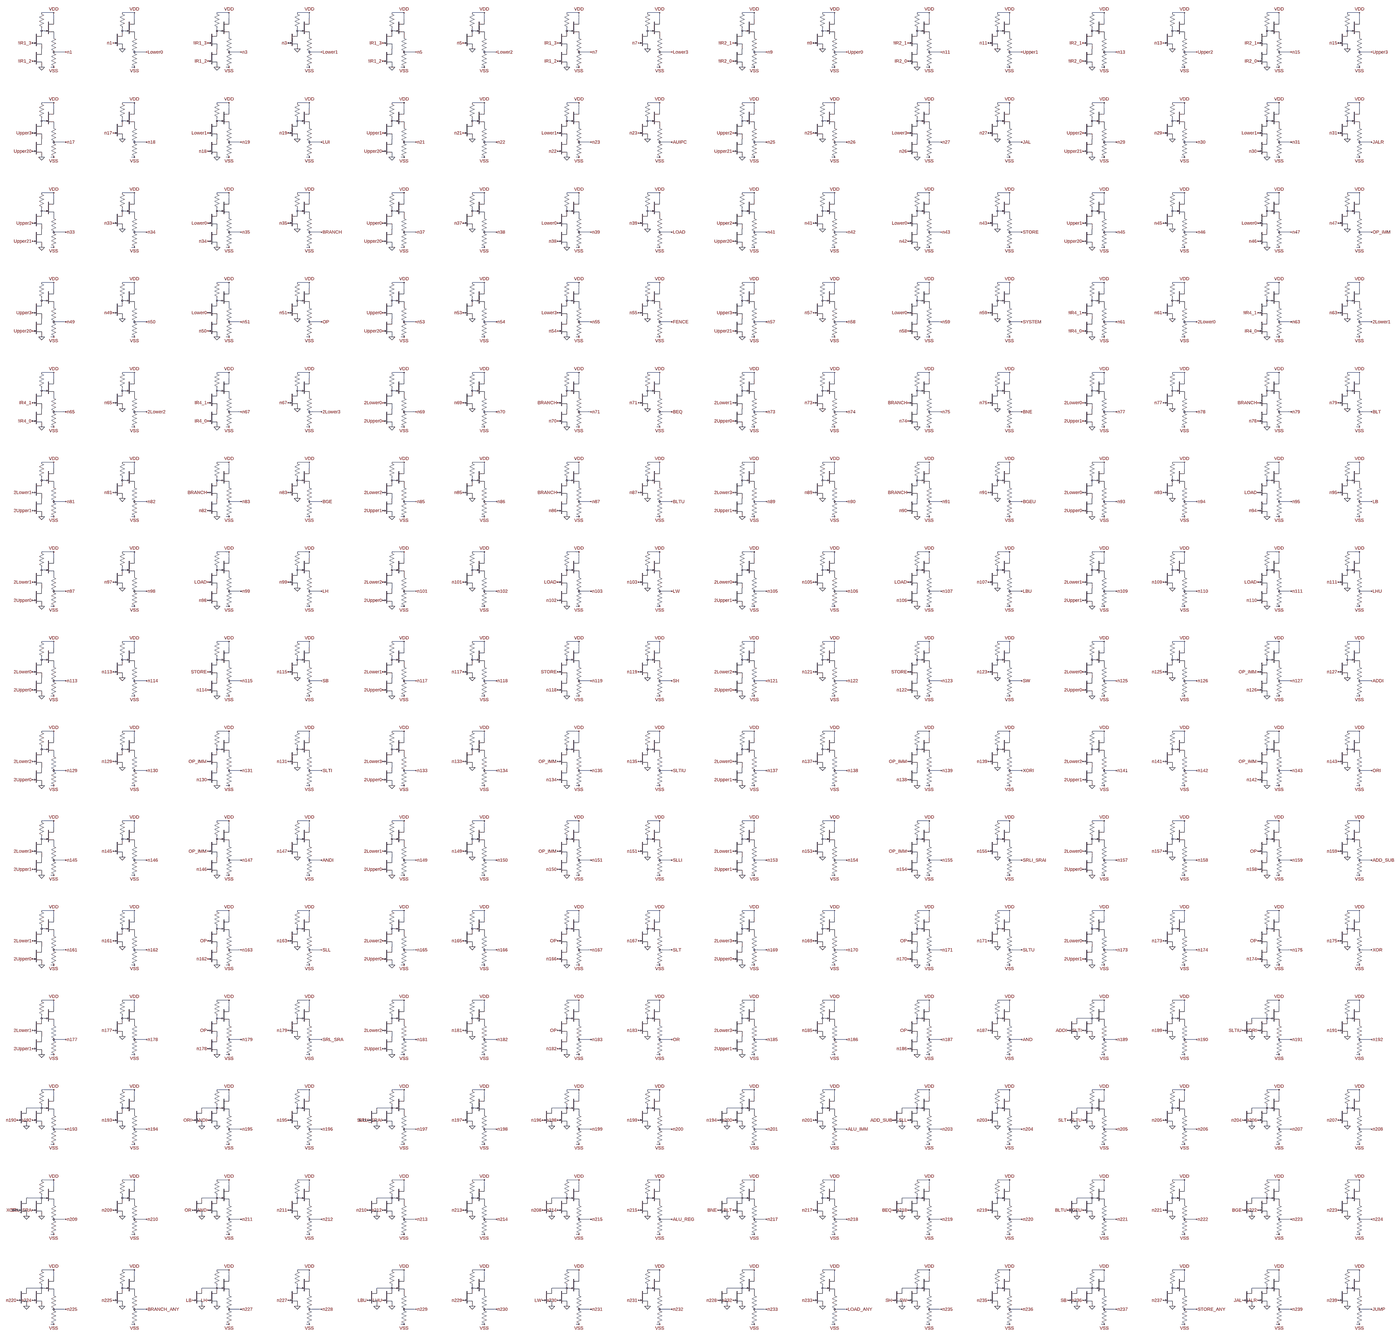
[diagram p0: schematic rv32i_decoder.asc, whole sheet]
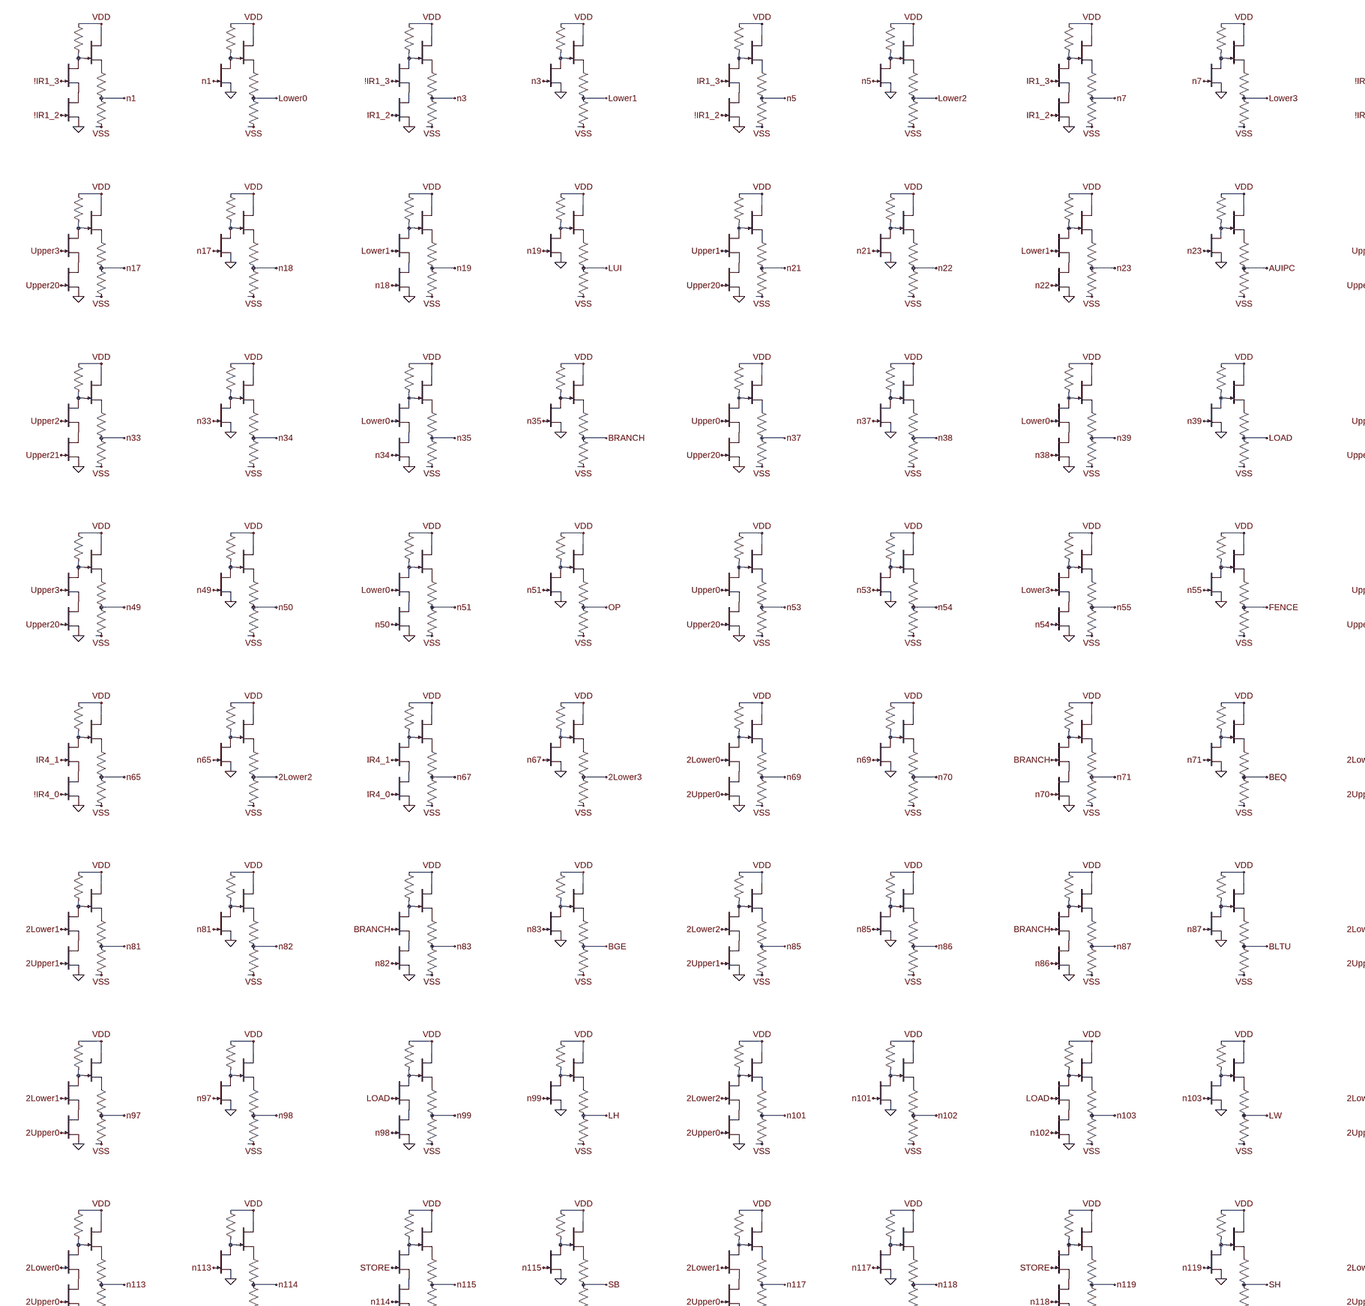
[diagram p1: schematic rv32i_decoder.asc, part, row 1 of 2, column 1 of 2]
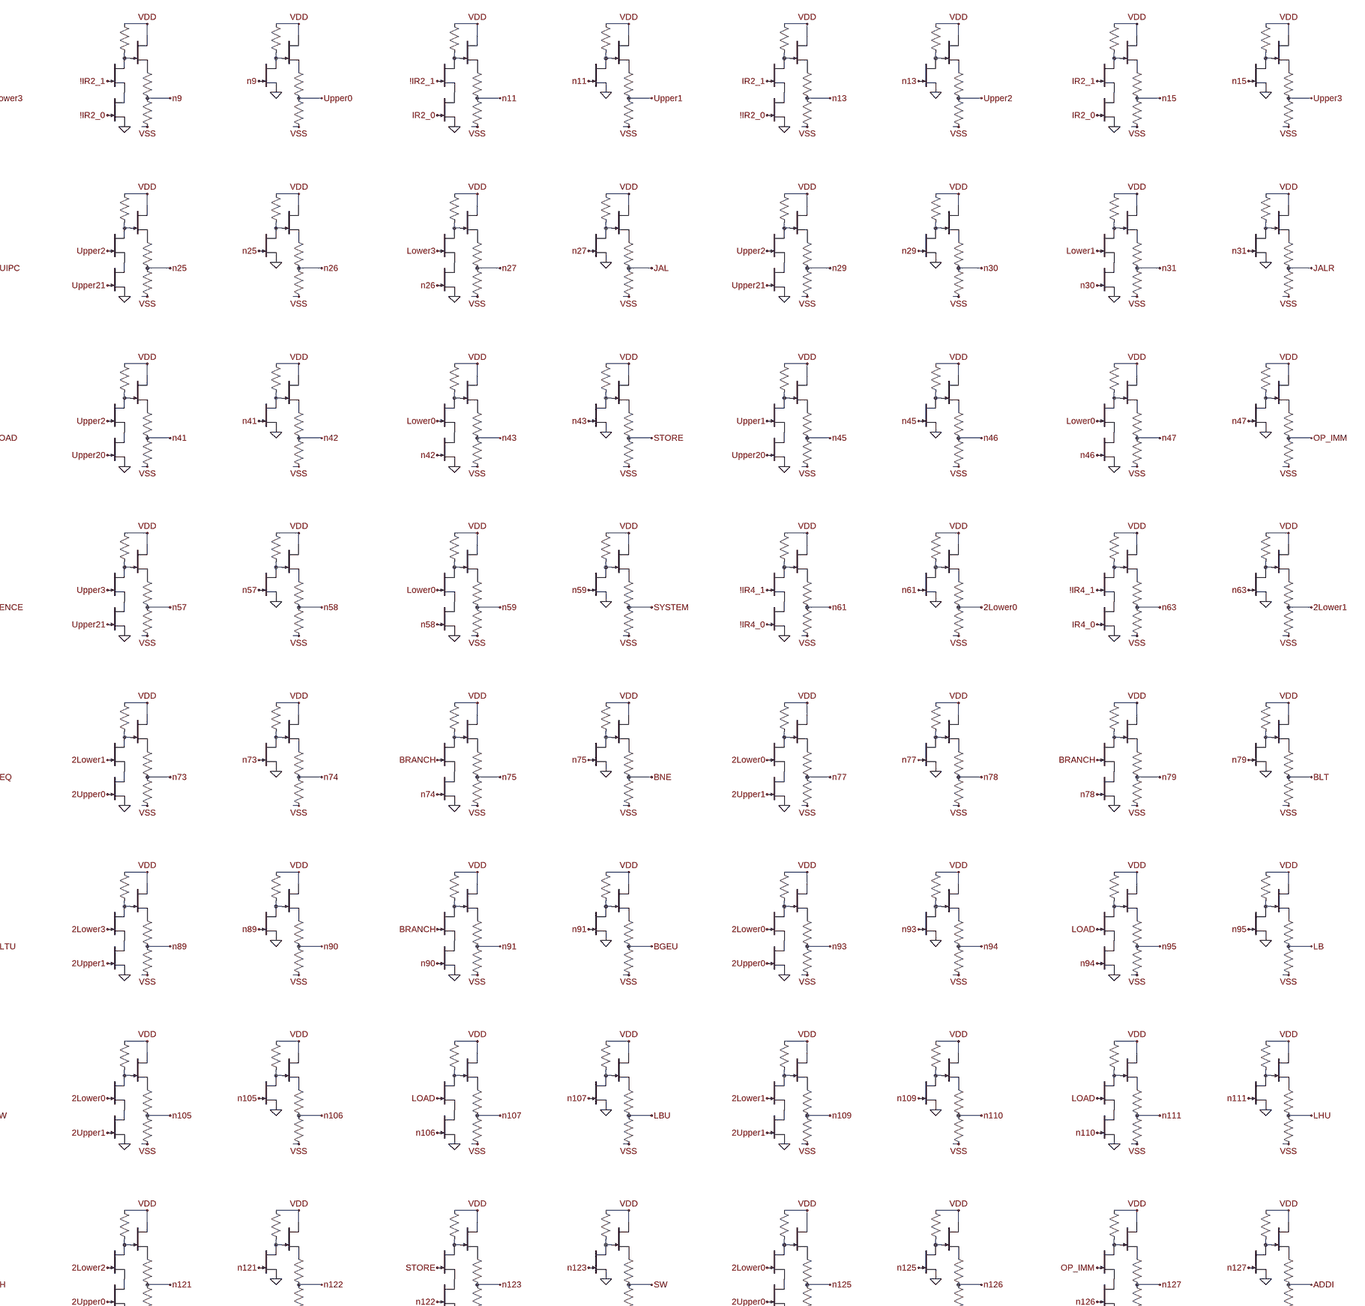
[diagram p2: schematic rv32i_decoder.asc, part, row 1 of 2, column 2 of 2]
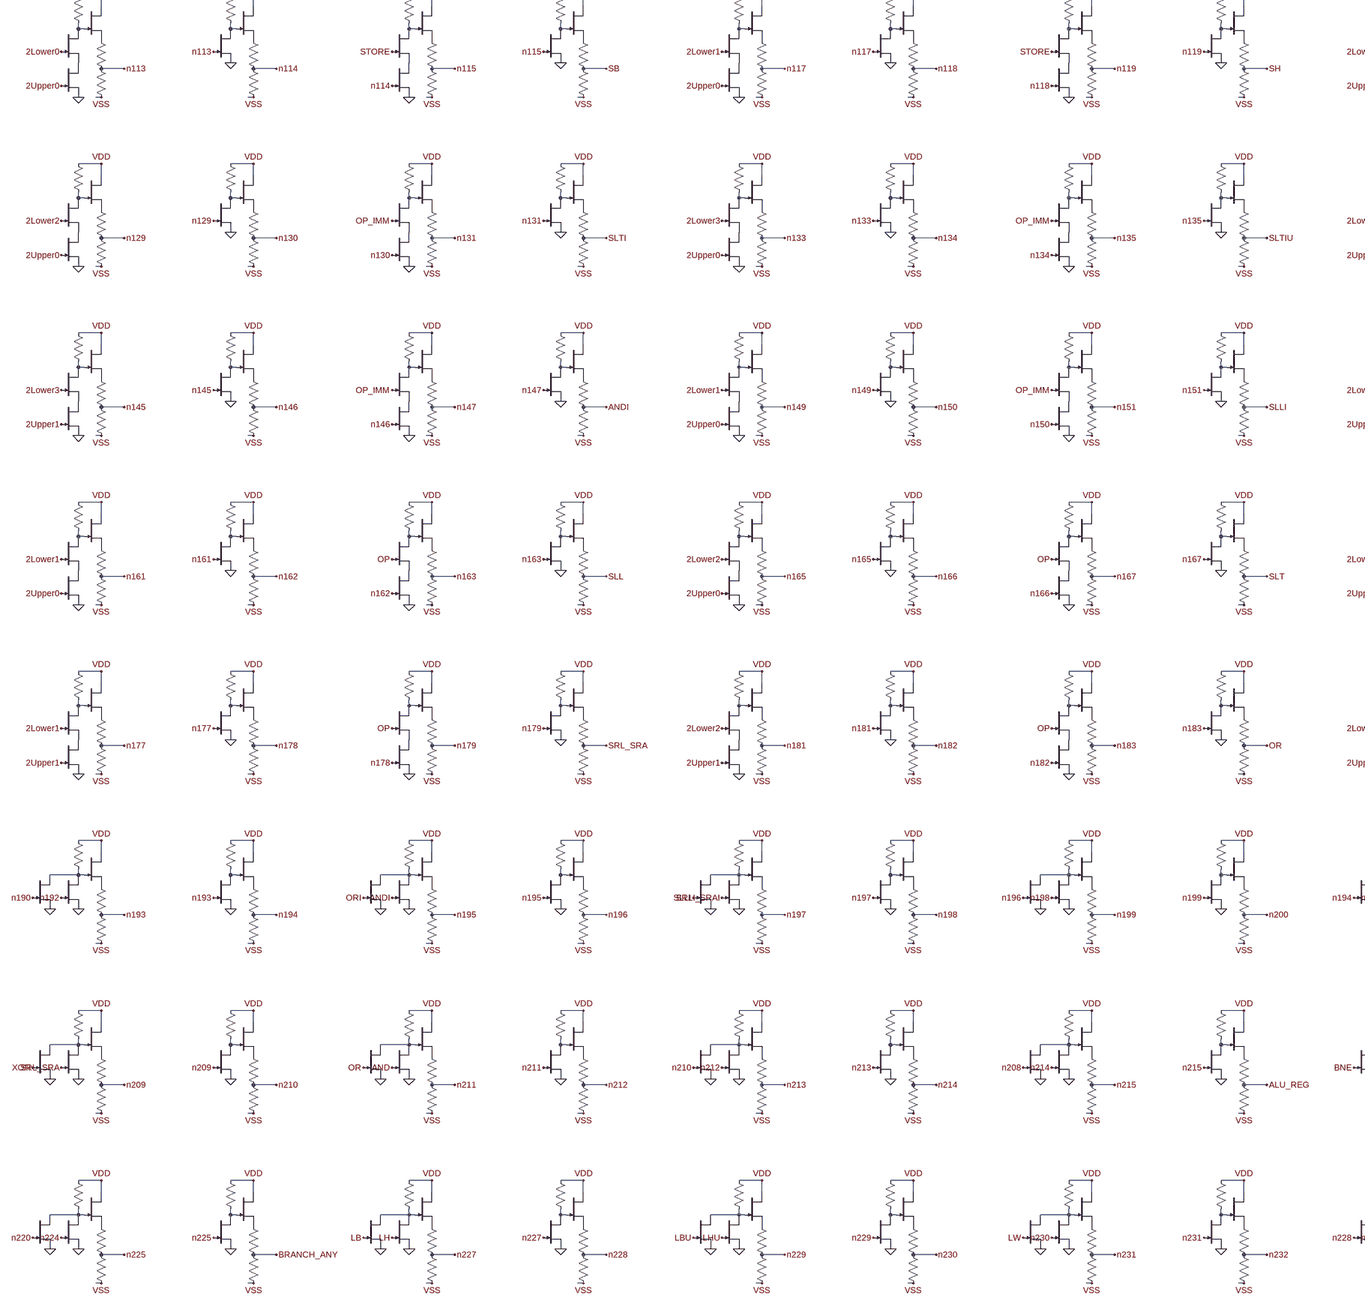
[diagram p3: schematic rv32i_decoder.asc, part, row 2 of 2, column 1 of 2]
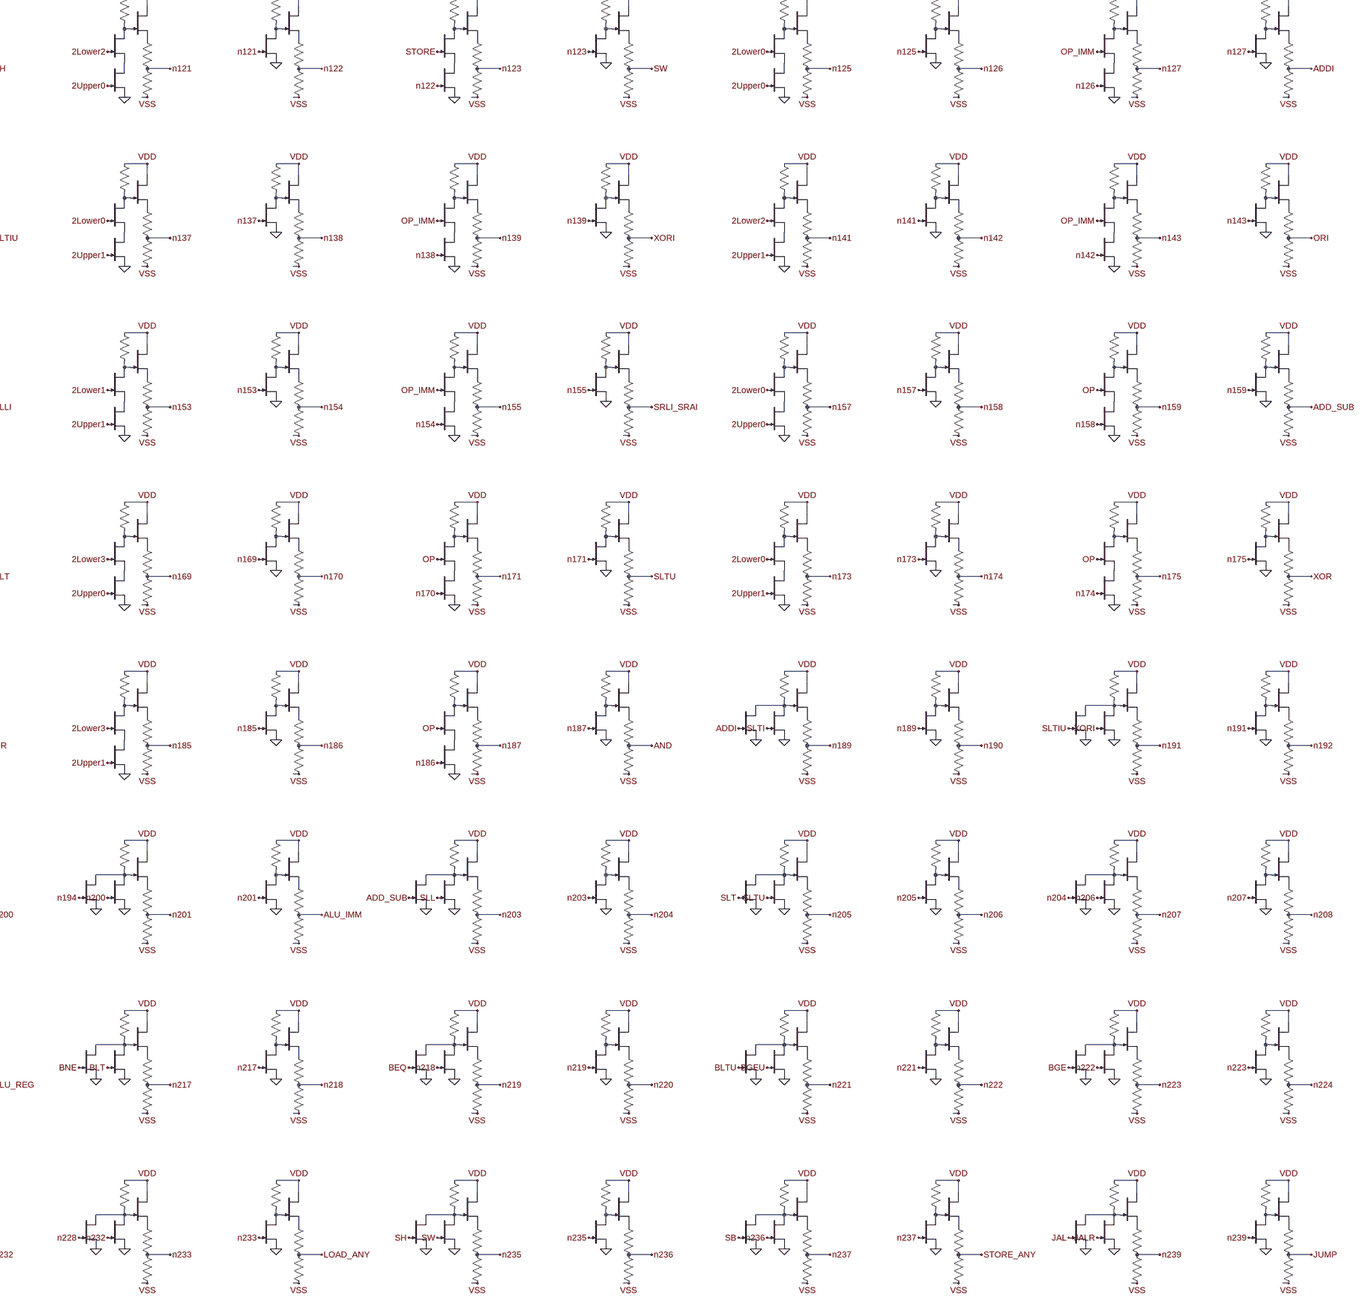
[diagram p4: schematic rv32i_decoder.asc, part, row 2 of 2, column 2 of 2]
* rv32i_decoder.asc
R1 VDD N001 100k
J_F1 VDD N001 P001 DR
R2 P001 n1 1k
R3 n1 VSS 4.8k
J_B1 N001 !IR1_3 P002 DR
J_A1 P002 !IR1_2 0 DR
R4 VDD N002 100k
J_F2 VDD N002 P003 DR
R5 P003 Lower0 1k
R6 Lower0 VSS 4.8k
J_B2 N002 n1 0 DR
R7 VDD N003 100k
J_F3 VDD N003 P004 DR
R8 P004 n3 1k
R9 n3 VSS 4.8k
J_B3 N003 !IR1_3 P005 DR
J_A2 P005 IR1_2 0 DR
R10 VDD N004 100k
J_F4 VDD N004 P006 DR
R11 P006 Lower1 1k
R12 Lower1 VSS 4.8k
J_B4 N004 n3 0 DR
R13 VDD N005 100k
J_F5 VDD N005 P007 DR
R14 P007 n5 1k
R15 n5 VSS 4.8k
J_B5 N005 IR1_3 P008 DR
J_A3 P008 !IR1_2 0 DR
R16 VDD N006 100k
J_F6 VDD N006 P009 DR
R17 P009 Lower2 1k
R18 Lower2 VSS 4.8k
J_B6 N006 n5 0 DR
R19 VDD N007 100k
J_F7 VDD N007 P010 DR
R20 P010 n7 1k
R21 n7 VSS 4.8k
J_B7 N007 IR1_3 P011 DR
J_A4 P011 IR1_2 0 DR
R22 VDD N008 100k
J_F8 VDD N008 P012 DR
R23 P012 Lower3 1k
R24 Lower3 VSS 4.8k
J_B8 N008 n7 0 DR
R25 VDD N009 100k
J_F9 VDD N009 P013 DR
R26 P013 n9 1k
R27 n9 VSS 4.8k
J_B9 N009 !IR2_1 P014 DR
J_A5 P014 !IR2_0 0 DR
R28 VDD N010 100k
J_F10 VDD N010 P015 DR
R29 P015 Upper0 1k
R30 Upper0 VSS 4.8k
J_B10 N010 n9 0 DR
R31 VDD N011 100k
J_F11 VDD N011 P016 DR
R32 P016 n11 1k
R33 n11 VSS 4.8k
J_B11 N011 !IR2_1 P017 DR
J_A6 P017 IR2_0 0 DR
R34 VDD N012 100k
J_F12 VDD N012 P018 DR
R35 P018 Upper1 1k
R36 Upper1 VSS 4.8k
J_B12 N012 n11 0 DR
R37 VDD N013 100k
J_F13 VDD N013 P019 DR
R38 P019 n13 1k
R39 n13 VSS 4.8k
J_B13 N013 IR2_1 P020 DR
J_A7 P020 !IR2_0 0 DR
R40 VDD N014 100k
J_F14 VDD N014 P021 DR
R41 P021 Upper2 1k
R42 Upper2 VSS 4.8k
J_B14 N014 n13 0 DR
R43 VDD N015 100k
J_F15 VDD N015 P022 DR
R44 P022 n15 1k
R45 n15 VSS 4.8k
J_B15 N015 IR2_1 P023 DR
J_A8 P023 IR2_0 0 DR
R46 VDD N016 100k
J_F16 VDD N016 P024 DR
R47 P024 Upper3 1k
R48 Upper3 VSS 4.8k
J_B16 N016 n15 0 DR
R49 VDD N017 100k
J_F17 VDD N017 P025 DR
R50 P025 n17 1k
R51 n17 VSS 4.8k
J_B17 N017 Upper3 P026 DR
J_A9 P026 Upper20 0 DR
R52 VDD N018 100k
J_F18 VDD N018 P027 DR
R53 P027 n18 1k
R54 n18 VSS 4.8k
J_B18 N018 n17 0 DR
R55 VDD N019 100k
J_F19 VDD N019 P028 DR
R56 P028 n19 1k
R57 n19 VSS 4.8k
J_B19 N019 Lower1 P029 DR
J_A10 P029 n18 0 DR
R58 VDD N020 100k
J_F20 VDD N020 P030 DR
R59 P030 LUI 1k
R60 LUI VSS 4.8k
J_B20 N020 n19 0 DR
R61 VDD N021 100k
J_F21 VDD N021 P031 DR
R62 P031 n21 1k
R63 n21 VSS 4.8k
J_B21 N021 Upper1 P032 DR
J_A11 P032 Upper20 0 DR
R64 VDD N022 100k
J_F22 VDD N022 P033 DR
R65 P033 n22 1k
R66 n22 VSS 4.8k
J_B22 N022 n21 0 DR
R67 VDD N023 100k
J_F23 VDD N023 P034 DR
R68 P034 n23 1k
R69 n23 VSS 4.8k
J_B23 N023 Lower1 P035 DR
J_A12 P035 n22 0 DR
R70 VDD N024 100k
J_F24 VDD N024 P036 DR
R71 P036 AUIPC 1k
R72 AUIPC VSS 4.8k
J_B24 N024 n23 0 DR
R73 VDD N025 100k
J_F25 VDD N025 P037 DR
R74 P037 n25 1k
R75 n25 VSS 4.8k
J_B25 N025 Upper2 P038 DR
J_A13 P038 Upper21 0 DR
R76 VDD N026 100k
J_F26 VDD N026 P039 DR
R77 P039 n26 1k
R78 n26 VSS 4.8k
J_B26 N026 n25 0 DR
R79 VDD N027 100k
J_F27 VDD N027 P040 DR
R80 P040 n27 1k
R81 n27 VSS 4.8k
J_B27 N027 Lower3 P041 DR
J_A14 P041 n26 0 DR
R82 VDD N028 100k
J_F28 VDD N028 P042 DR
R83 P042 JAL 1k
R84 JAL VSS 4.8k
J_B28 N028 n27 0 DR
R85 VDD N029 100k
J_F29 VDD N029 P043 DR
R86 P043 n29 1k
R87 n29 VSS 4.8k
J_B29 N029 Upper2 P044 DR
J_A15 P044 Upper21 0 DR
R88 VDD N030 100k
J_F30 VDD N030 P045 DR
R89 P045 n30 1k
R90 n30 VSS 4.8k
J_B30 N030 n29 0 DR
R91 VDD N031 100k
J_F31 VDD N031 P046 DR
R92 P046 n31 1k
R93 n31 VSS 4.8k
J_B31 N031 Lower1 P047 DR
J_A16 P047 n30 0 DR
R94 VDD N032 100k
J_F32 VDD N032 P048 DR
R95 P048 JALR 1k
R96 JALR VSS 4.8k
J_B32 N032 n31 0 DR
R97 VDD N033 100k
J_F33 VDD N033 P049 DR
R98 P049 n33 1k
R99 n33 VSS 4.8k
J_B33 N033 Upper2 P050 DR
J_A17 P050 Upper21 0 DR
R100 VDD N034 100k
J_F34 VDD N034 P051 DR
R101 P051 n34 1k
R102 n34 VSS 4.8k
J_B34 N034 n33 0 DR
R103 VDD N035 100k
J_F35 VDD N035 P052 DR
R104 P052 n35 1k
R105 n35 VSS 4.8k
J_B35 N035 Lower0 P053 DR
J_A18 P053 n34 0 DR
R106 VDD N036 100k
J_F36 VDD N036 P054 DR
R107 P054 BRANCH 1k
R108 BRANCH VSS 4.8k
J_B36 N036 n35 0 DR
R109 VDD N037 100k
J_F37 VDD N037 P055 DR
R110 P055 n37 1k
R111 n37 VSS 4.8k
J_B37 N037 Upper0 P056 DR
J_A19 P056 Upper20 0 DR
R112 VDD N038 100k
J_F38 VDD N038 P057 DR
R113 P057 n38 1k
R114 n38 VSS 4.8k
J_B38 N038 n37 0 DR
R115 VDD N039 100k
J_F39 VDD N039 P058 DR
R116 P058 n39 1k
R117 n39 VSS 4.8k
J_B39 N039 Lower0 P059 DR
J_A20 P059 n38 0 DR
R118 VDD N040 100k
J_F40 VDD N040 P060 DR
R119 P060 LOAD 1k
R120 LOAD VSS 4.8k
J_B40 N040 n39 0 DR
R121 VDD N041 100k
J_F41 VDD N041 P061 DR
R122 P061 n41 1k
R123 n41 VSS 4.8k
J_B41 N041 Upper2 P062 DR
J_A21 P062 Upper20 0 DR
R124 VDD N042 100k
J_F42 VDD N042 P063 DR
R125 P063 n42 1k
R126 n42 VSS 4.8k
J_B42 N042 n41 0 DR
R127 VDD N043 100k
J_F43 VDD N043 P064 DR
R128 P064 n43 1k
R129 n43 VSS 4.8k
J_B43 N043 Lower0 P065 DR
J_A22 P065 n42 0 DR
R130 VDD N044 100k
J_F44 VDD N044 P066 DR
R131 P066 STORE 1k
R132 STORE VSS 4.8k
J_B44 N044 n43 0 DR
R133 VDD N045 100k
J_F45 VDD N045 P067 DR
R134 P067 n45 1k
R135 n45 VSS 4.8k
J_B45 N045 Upper1 P068 DR
J_A23 P068 Upper20 0 DR
R136 VDD N046 100k
J_F46 VDD N046 P069 DR
R137 P069 n46 1k
R138 n46 VSS 4.8k
J_B46 N046 n45 0 DR
R139 VDD N047 100k
J_F47 VDD N047 P070 DR
R140 P070 n47 1k
R141 n47 VSS 4.8k
J_B47 N047 Lower0 P071 DR
J_A24 P071 n46 0 DR
R142 VDD N048 100k
J_F48 VDD N048 P072 DR
R143 P072 OP_IMM 1k
R144 OP_IMM VSS 4.8k
J_B48 N048 n47 0 DR
R145 VDD N049 100k
J_F49 VDD N049 P073 DR
R146 P073 n49 1k
R147 n49 VSS 4.8k
J_B49 N049 Upper3 P074 DR
J_A25 P074 Upper20 0 DR
R148 VDD N050 100k
J_F50 VDD N050 P075 DR
R149 P075 n50 1k
R150 n50 VSS 4.8k
J_B50 N050 n49 0 DR
R151 VDD N051 100k
J_F51 VDD N051 P076 DR
R152 P076 n51 1k
R153 n51 VSS 4.8k
J_B51 N051 Lower0 P077 DR
J_A26 P077 n50 0 DR
R154 VDD N052 100k
J_F52 VDD N052 P078 DR
R155 P078 OP 1k
R156 OP VSS 4.8k
J_B52 N052 n51 0 DR
R157 VDD N053 100k
J_F53 VDD N053 P079 DR
R158 P079 n53 1k
R159 n53 VSS 4.8k
J_B53 N053 Upper0 P080 DR
J_A27 P080 Upper20 0 DR
R160 VDD N054 100k
J_F54 VDD N054 P081 DR
R161 P081 n54 1k
R162 n54 VSS 4.8k
J_B54 N054 n53 0 DR
R163 VDD N055 100k
J_F55 VDD N055 P082 DR
R164 P082 n55 1k
R165 n55 VSS 4.8k
J_B55 N055 Lower3 P083 DR
J_A28 P083 n54 0 DR
R166 VDD N056 100k
J_F56 VDD N056 P084 DR
R167 P084 FENCE 1k
R168 FENCE VSS 4.8k
J_B56 N056 n55 0 DR
R169 VDD N057 100k
J_F57 VDD N057 P085 DR
R170 P085 n57 1k
R171 n57 VSS 4.8k
J_B57 N057 Upper3 P086 DR
J_A29 P086 Upper21 0 DR
R172 VDD N058 100k
J_F58 VDD N058 P087 DR
R173 P087 n58 1k
R174 n58 VSS 4.8k
J_B58 N058 n57 0 DR
R175 VDD N059 100k
J_F59 VDD N059 P088 DR
R176 P088 n59 1k
R177 n59 VSS 4.8k
J_B59 N059 Lower0 P089 DR
J_A30 P089 n58 0 DR
R178 VDD N060 100k
J_F60 VDD N060 P090 DR
R179 P090 SYSTEM 1k
R180 SYSTEM VSS 4.8k
J_B60 N060 n59 0 DR
R181 VDD N061 100k
J_F61 VDD N061 P091 DR
R182 P091 n61 1k
R183 n61 VSS 4.8k
J_B61 N061 !IR4_1 P092 DR
J_A31 P092 !IR4_0 0 DR
R184 VDD N062 100k
J_F62 VDD N062 P093 DR
R185 P093 2Lower0 1k
R186 2Lower0 VSS 4.8k
J_B62 N062 n61 0 DR
R187 VDD N063 100k
J_F63 VDD N063 P094 DR
R188 P094 n63 1k
R189 n63 VSS 4.8k
J_B63 N063 !IR4_1 P095 DR
J_A32 P095 IR4_0 0 DR
R190 VDD N064 100k
J_F64 VDD N064 P096 DR
R191 P096 2Lower1 1k
R192 2Lower1 VSS 4.8k
J_B64 N064 n63 0 DR
R193 VDD N065 100k
J_F65 VDD N065 P097 DR
R194 P097 n65 1k
R195 n65 VSS 4.8k
J_B65 N065 IR4_1 P098 DR
J_A33 P098 !IR4_0 0 DR
R196 VDD N066 100k
J_F66 VDD N066 P099 DR
R197 P099 2Lower2 1k
R198 2Lower2 VSS 4.8k
J_B66 N066 n65 0 DR
R199 VDD N067 100k
J_F67 VDD N067 P100 DR
R200 P100 n67 1k
R201 n67 VSS 4.8k
J_B67 N067 IR4_1 P101 DR
J_A34 P101 IR4_0 0 DR
R202 VDD N068 100k
J_F68 VDD N068 P102 DR
R203 P102 2Lower3 1k
R204 2Lower3 VSS 4.8k
J_B68 N068 n67 0 DR
R205 VDD N069 100k
J_F69 VDD N069 P103 DR
R206 P103 n69 1k
R207 n69 VSS 4.8k
J_B69 N069 2Lower0 P104 DR
J_A35 P104 2Upper0 0 DR
R208 VDD N070 100k
J_F70 VDD N070 P105 DR
R209 P105 n70 1k
R210 n70 VSS 4.8k
J_B70 N070 n69 0 DR
R211 VDD N071 100k
J_F71 VDD N071 P106 DR
R212 P106 n71 1k
R213 n71 VSS 4.8k
J_B71 N071 BRANCH P107 DR
J_A36 P107 n70 0 DR
R214 VDD N072 100k
J_F72 VDD N072 P108 DR
R215 P108 BEQ 1k
R216 BEQ VSS 4.8k
J_B72 N072 n71 0 DR
R217 VDD N073 100k
J_F73 VDD N073 P109 DR
R218 P109 n73 1k
R219 n73 VSS 4.8k
J_B73 N073 2Lower1 P110 DR
J_A37 P110 2Upper0 0 DR
R220 VDD N074 100k
J_F74 VDD N074 P111 DR
R221 P111 n74 1k
R222 n74 VSS 4.8k
J_B74 N074 n73 0 DR
R223 VDD N075 100k
J_F75 VDD N075 P112 DR
R224 P112 n75 1k
R225 n75 VSS 4.8k
J_B75 N075 BRANCH P113 DR
J_A38 P113 n74 0 DR
R226 VDD N076 100k
J_F76 VDD N076 P114 DR
R227 P114 BNE 1k
R228 BNE VSS 4.8k
J_B76 N076 n75 0 DR
R229 VDD N077 100k
J_F77 VDD N077 P115 DR
R230 P115 n77 1k
R231 n77 VSS 4.8k
J_B77 N077 2Lower0 P116 DR
J_A39 P116 2Upper1 0 DR
R232 VDD N078 100k
J_F78 VDD N078 P117 DR
R233 P117 n78 1k
R234 n78 VSS 4.8k
J_B78 N078 n77 0 DR
R235 VDD N079 100k
J_F79 VDD N079 P118 DR
R236 P118 n79 1k
R237 n79 VSS 4.8k
J_B79 N079 BRANCH P119 DR
J_A40 P119 n78 0 DR
R238 VDD N080 100k
J_F80 VDD N080 P120 DR
R239 P120 BLT 1k
R240 BLT VSS 4.8k
J_B80 N080 n79 0 DR
R241 VDD N081 100k
J_F81 VDD N081 P121 DR
R242 P121 n81 1k
R243 n81 VSS 4.8k
J_B81 N081 2Lower1 P122 DR
J_A41 P122 2Upper1 0 DR
R244 VDD N082 100k
J_F82 VDD N082 P123 DR
R245 P123 n82 1k
R246 n82 VSS 4.8k
J_B82 N082 n81 0 DR
R247 VDD N083 100k
J_F83 VDD N083 P124 DR
R248 P124 n83 1k
R249 n83 VSS 4.8k
J_B83 N083 BRANCH P125 DR
J_A42 P125 n82 0 DR
R250 VDD N084 100k
J_F84 VDD N084 P126 DR
R251 P126 BGE 1k
R252 BGE VSS 4.8k
J_B84 N084 n83 0 DR
R253 VDD N085 100k
J_F85 VDD N085 P127 DR
R254 P127 n85 1k
R255 n85 VSS 4.8k
J_B85 N085 2Lower2 P128 DR
J_A43 P128 2Upper1 0 DR
R256 VDD N086 100k
J_F86 VDD N086 P129 DR
R257 P129 n86 1k
R258 n86 VSS 4.8k
J_B86 N086 n85 0 DR
R259 VDD N087 100k
J_F87 VDD N087 P130 DR
R260 P130 n87 1k
R261 n87 VSS 4.8k
J_B87 N087 BRANCH P131 DR
J_A44 P131 n86 0 DR
R262 VDD N088 100k
J_F88 VDD N088 P132 DR
R263 P132 BLTU 1k
R264 BLTU VSS 4.8k
J_B88 N088 n87 0 DR
R265 VDD N089 100k
J_F89 VDD N089 P133 DR
R266 P133 n89 1k
R267 n89 VSS 4.8k
J_B89 N089 2Lower3 P134 DR
J_A45 P134 2Upper1 0 DR
R268 VDD N090 100k
J_F90 VDD N090 P135 DR
R269 P135 n90 1k
R270 n90 VSS 4.8k
J_B90 N090 n89 0 DR
R271 VDD N091 100k
J_F91 VDD N091 P136 DR
R272 P136 n91 1k
R273 n91 VSS 4.8k
J_B91 N091 BRANCH P137 DR
J_A46 P137 n90 0 DR
R274 VDD N092 100k
J_F92 VDD N092 P138 DR
R275 P138 BGEU 1k
R276 BGEU VSS 4.8k
J_B92 N092 n91 0 DR
R277 VDD N093 100k
J_F93 VDD N093 P139 DR
R278 P139 n93 1k
R279 n93 VSS 4.8k
J_B93 N093 2Lower0 P140 DR
J_A47 P140 2Upper0 0 DR
R280 VDD N094 100k
J_F94 VDD N094 P141 DR
R281 P141 n94 1k
R282 n94 VSS 4.8k
J_B94 N094 n93 0 DR
R283 VDD N095 100k
J_F95 VDD N095 P142 DR
R284 P142 n95 1k
R285 n95 VSS 4.8k
J_B95 N095 LOAD P143 DR
J_A48 P143 n94 0 DR
R286 VDD N096 100k
J_F96 VDD N096 P144 DR
R287 P144 LB 1k
R288 LB VSS 4.8k
J_B96 N096 n95 0 DR
R289 VDD N097 100k
J_F97 VDD N097 P145 DR
R290 P145 n97 1k
R291 n97 VSS 4.8k
J_B97 N097 2Lower1 P146 DR
J_A49 P146 2Upper0 0 DR
R292 VDD N098 100k
J_F98 VDD N098 P147 DR
R293 P147 n98 1k
R294 n98 VSS 4.8k
J_B98 N098 n97 0 DR
R295 VDD N099 100k
J_F99 VDD N099 P148 DR
R296 P148 n99 1k
R297 n99 VSS 4.8k
J_B99 N099 LOAD P149 DR
J_A50 P149 n98 0 DR
R298 VDD N100 100k
J_F100 VDD N100 P150 DR
R299 P150 LH 1k
R300 LH VSS 4.8k
J_B100 N100 n99 0 DR
R301 VDD N104 100k
J_F101 VDD N104 P151 DR
R302 P151 n101 1k
R303 n101 VSS 4.8k
J_B101 N104 2Lower2 P152 DR
J_A51 P152 2Upper0 0 DR
R304 VDD N108 100k
J_F102 VDD N108 P153 DR
R305 P153 n102 1k
R306 n102 VSS 4.8k
J_B102 N108 n101 0 DR
R307 VDD N112 100k
J_F103 VDD N112 P154 DR
R308 P154 n103 1k
R309 n103 VSS 4.8k
J_B103 N112 LOAD P155 DR
J_A52 P155 n102 0 DR
R310 VDD N116 100k
J_F104 VDD N116 P156 DR
R311 P156 LW 1k
R312 LW VSS 4.8k
J_B104 N116 n103 0 DR
R313 VDD N120 100k
J_F105 VDD N120 P157 DR
R314 P157 n105 1k
R315 n105 VSS 4.8k
J_B105 N120 2Lower0 P158 DR
J_A53 P158 2Upper1 0 DR
R316 VDD N124 100k
J_F106 VDD N124 P159 DR
R317 P159 n106 1k
R318 n106 VSS 4.8k
J_B106 N124 n105 0 DR
R319 VDD N128 100k
J_F107 VDD N128 P160 DR
R320 P160 n107 1k
R321 n107 VSS 4.8k
J_B107 N128 LOAD P161 DR
J_A54 P161 n106 0 DR
R322 VDD N132 100k
J_F108 VDD N132 P162 DR
R323 P162 LBU 1k
R324 LBU VSS 4.8k
J_B108 N132 n107 0 DR
R325 VDD N136 100k
J_F109 VDD N136 P163 DR
R326 P163 n109 1k
R327 n109 VSS 4.8k
J_B109 N136 2Lower1 P164 DR
J_A55 P164 2Upper1 0 DR
R328 VDD N140 100k
J_F110 VDD N140 P165 DR
R329 P165 n110 1k
R330 n110 VSS 4.8k
J_B110 N140 n109 0 DR
R331 VDD N144 100k
J_F111 VDD N144 P166 DR
R332 P166 n111 1k
R333 n111 VSS 4.8k
J_B111 N144 LOAD P167 DR
J_A56 P167 n110 0 DR
R334 VDD N148 100k
J_F112 VDD N148 P168 DR
R335 P168 LHU 1k
R336 LHU VSS 4.8k
J_B112 N148 n111 0 DR
R337 VDD N152 100k
J_F113 VDD N152 P169 DR
R338 P169 n113 1k
R339 n113 VSS 4.8k
J_B113 N152 2Lower0 P170 DR
J_A57 P170 2Upper0 0 DR
R340 VDD N156 100k
J_F114 VDD N156 P171 DR
R341 P171 n114 1k
R342 n114 VSS 4.8k
J_B114 N156 n113 0 DR
R343 VDD N160 100k
J_F115 VDD N160 P172 DR
R344 P172 n115 1k
R345 n115 VSS 4.8k
J_B115 N160 STORE P173 DR
J_A58 P173 n114 0 DR
R346 VDD N164 100k
J_F116 VDD N164 P174 DR
R347 P174 SB 1k
R348 SB VSS 4.8k
J_B116 N164 n115 0 DR
R349 VDD N168 100k
J_F117 VDD N168 P175 DR
R350 P175 n117 1k
R351 n117 VSS 4.8k
J_B117 N168 2Lower1 P176 DR
J_A59 P176 2Upper0 0 DR
R352 VDD N172 100k
J_F118 VDD N172 P177 DR
R353 P177 n118 1k
R354 n118 VSS 4.8k
J_B118 N172 n117 0 DR
R355 VDD N176 100k
J_F119 VDD N176 P178 DR
R356 P178 n119 1k
R357 n119 VSS 4.8k
J_B119 N176 STORE P179 DR
J_A60 P179 n118 0 DR
R358 VDD N180 100k
J_F120 VDD N180 P180 DR
R359 P180 SH 1k
R360 SH VSS 4.8k
J_B120 N180 n119 0 DR
R361 VDD N184 100k
J_F121 VDD N184 P181 DR
R362 P181 n121 1k
R363 n121 VSS 4.8k
J_B121 N184 2Lower2 P182 DR
J_A61 P182 2Upper0 0 DR
R364 VDD N188 100k
J_F122 VDD N188 P183 DR
R365 P183 n122 1k
R366 n122 VSS 4.8k
J_B122 N188 n121 0 DR
R367 VDD N202 100k
J_F123 VDD N202 P184 DR
R368 P184 n123 1k
R369 n123 VSS 4.8k
J_B123 N202 STORE P185 DR
J_A62 P185 n122 0 DR
R370 VDD N216 100k
J_F124 VDD N216 P186 DR
R371 P186 SW 1k
R372 SW VSS 4.8k
J_B124 N216 n123 0 DR
R373 VDD N226 100k
J_F125 VDD N226 P187 DR
R374 P187 n125 1k
R375 n125 VSS 4.8k
J_B125 N226 2Lower0 P188 DR
J_A63 P188 2Upper0 0 DR
R376 VDD N234 100k
J_F126 VDD N234 P189 DR
R377 P189 n126 1k
R378 n126 VSS 4.8k
J_B126 N234 n125 0 DR
R379 VDD N238 100k
J_F127 VDD N238 P190 DR
R380 P190 n127 1k
R381 n127 VSS 4.8k
J_B127 N238 OP_IMM P191 DR
J_A64 P191 n126 0 DR
R382 VDD N240 100k
J_F128 VDD N240 P192 DR
R383 P192 ADDI 1k
R384 ADDI VSS 4.8k
J_B128 N240 n127 0 DR
R385 VDD N241 100k
J_F129 VDD N241 P193 DR
R386 P193 n129 1k
R387 n129 VSS 4.8k
J_B129 N241 2Lower2 P194 DR
J_A65 P194 2Upper0 0 DR
R388 VDD N242 100k
J_F130 VDD N242 P195 DR
R389 P195 n130 1k
R390 n130 VSS 4.8k
J_B130 N242 n129 0 DR
R391 VDD N243 100k
J_F131 VDD N243 P196 DR
R392 P196 n131 1k
R393 n131 VSS 4.8k
J_B131 N243 OP_IMM P197 DR
J_A66 P197 n130 0 DR
R394 VDD N244 100k
J_F132 VDD N244 P198 DR
R395 P198 SLTI 1k
R396 SLTI VSS 4.8k
J_B132 N244 n131 0 DR
R397 VDD N245 100k
J_F133 VDD N245 P199 DR
R398 P199 n133 1k
R399 n133 VSS 4.8k
J_B133 N245 2Lower3 P200 DR
J_A67 P200 2Upper0 0 DR
R400 VDD N246 100k
J_F134 VDD N246 P201 DR
R401 P201 n134 1k
R402 n134 VSS 4.8k
J_B134 N246 n133 0 DR
R403 VDD N247 100k
J_F135 VDD N247 P202 DR
R404 P202 n135 1k
R405 n135 VSS 4.8k
J_B135 N247 OP_IMM P203 DR
J_A68 P203 n134 0 DR
R406 VDD N248 100k
J_F136 VDD N248 P204 DR
R407 P204 SLTIU 1k
R408 SLTIU VSS 4.8k
J_B136 N248 n135 0 DR
R409 VDD N249 100k
J_F137 VDD N249 P205 DR
R410 P205 n137 1k
R411 n137 VSS 4.8k
J_B137 N249 2Lower0 P206 DR
J_A69 P206 2Upper1 0 DR
R412 VDD N250 100k
J_F138 VDD N250 P207 DR
R413 P207 n138 1k
R414 n138 VSS 4.8k
J_B138 N250 n137 0 DR
R415 VDD N251 100k
J_F139 VDD N251 P208 DR
R416 P208 n139 1k
R417 n139 VSS 4.8k
J_B139 N251 OP_IMM P209 DR
J_A70 P209 n138 0 DR
R418 VDD N252 100k
J_F140 VDD N252 P210 DR
R419 P210 XORI 1k
R420 XORI VSS 4.8k
J_B140 N252 n139 0 DR
R421 VDD N253 100k
J_F141 VDD N253 P211 DR
R422 P211 n141 1k
R423 n141 VSS 4.8k
J_B141 N253 2Lower2 P212 DR
J_A71 P212 2Upper1 0 DR
R424 VDD N254 100k
J_F142 VDD N254 P213 DR
R425 P213 n142 1k
R426 n142 VSS 4.8k
J_B142 N254 n141 0 DR
R427 VDD N255 100k
J_F143 VDD N255 P214 DR
R428 P214 n143 1k
R429 n143 VSS 4.8k
J_B143 N255 OP_IMM P215 DR
J_A72 P215 n142 0 DR
R430 VDD N256 100k
J_F144 VDD N256 P216 DR
R431 P216 ORI 1k
R432 ORI VSS 4.8k
J_B144 N256 n143 0 DR
R433 VDD N257 100k
J_F145 VDD N257 P217 DR
R434 P217 n145 1k
R435 n145 VSS 4.8k
J_B145 N257 2Lower3 P218 DR
J_A73 P218 2Upper1 0 DR
R436 VDD N258 100k
J_F146 VDD N258 P219 DR
R437 P219 n146 1k
R438 n146 VSS 4.8k
J_B146 N258 n145 0 DR
R439 VDD N259 100k
J_F147 VDD N259 P220 DR
R440 P220 n147 1k
R441 n147 VSS 4.8k
J_B147 N259 OP_IMM P221 DR
J_A74 P221 n146 0 DR
R442 VDD N260 100k
J_F148 VDD N260 P222 DR
R443 P222 ANDI 1k
R444 ANDI VSS 4.8k
J_B148 N260 n147 0 DR
R445 VDD N261 100k
J_F149 VDD N261 P223 DR
R446 P223 n149 1k
R447 n149 VSS 4.8k
J_B149 N261 2Lower1 P224 DR
J_A75 P224 2Upper0 0 DR
R448 VDD N262 100k
J_F150 VDD N262 P225 DR
R449 P225 n150 1k
R450 n150 VSS 4.8k
J_B150 N262 n149 0 DR
R451 VDD N263 100k
J_F151 VDD N263 P226 DR
R452 P226 n151 1k
R453 n151 VSS 4.8k
J_B151 N263 OP_IMM P227 DR
J_A76 P227 n150 0 DR
R454 VDD N264 100k
J_F152 VDD N264 P228 DR
R455 P228 SLLI 1k
R456 SLLI VSS 4.8k
J_B152 N264 n151 0 DR
R457 VDD N265 100k
J_F153 VDD N265 P229 DR
R458 P229 n153 1k
R459 n153 VSS 4.8k
J_B153 N265 2Lower1 P230 DR
J_A77 P230 2Upper1 0 DR
R460 VDD N266 100k
J_F154 VDD N266 P231 DR
R461 P231 n154 1k
R462 n154 VSS 4.8k
J_B154 N266 n153 0 DR
R463 VDD N267 100k
J_F155 VDD N267 P232 DR
R464 P232 n155 1k
R465 n155 VSS 4.8k
J_B155 N267 OP_IMM P233 DR
J_A78 P233 n154 0 DR
R466 VDD N268 100k
J_F156 VDD N268 P234 DR
R467 P234 SRLI_SRAI 1k
R468 SRLI_SRAI VSS 4.8k
J_B156 N268 n155 0 DR
R469 VDD N269 100k
J_F157 VDD N269 P235 DR
R470 P235 n157 1k
R471 n157 VSS 4.8k
J_B157 N269 2Lower0 P236 DR
J_A79 P236 2Upper0 0 DR
R472 VDD N270 100k
J_F158 VDD N270 P237 DR
R473 P237 n158 1k
R474 n158 VSS 4.8k
J_B158 N270 n157 0 DR
R475 VDD N271 100k
J_F159 VDD N271 P238 DR
R476 P238 n159 1k
R477 n159 VSS 4.8k
J_B159 N271 OP P239 DR
J_A80 P239 n158 0 DR
R478 VDD N272 100k
J_F160 VDD N272 P240 DR
R479 P240 ADD_SUB 1k
R480 ADD_SUB VSS 4.8k
J_B160 N272 n159 0 DR
R481 VDD N273 100k
J_F161 VDD N273 P241 DR
R482 P241 n161 1k
R483 n161 VSS 4.8k
J_B161 N273 2Lower1 P242 DR
J_A81 P242 2Upper0 0 DR
R484 VDD N274 100k
J_F162 VDD N274 P243 DR
R485 P243 n162 1k
R486 n162 VSS 4.8k
J_B162 N274 n161 0 DR
R487 VDD N275 100k
J_F163 VDD N275 P244 DR
R488 P244 n163 1k
R489 n163 VSS 4.8k
J_B163 N275 OP P245 DR
J_A82 P245 n162 0 DR
R490 VDD N276 100k
J_F164 VDD N276 P246 DR
R491 P246 SLL 1k
R492 SLL VSS 4.8k
J_B164 N276 n163 0 DR
R493 VDD N277 100k
J_F165 VDD N277 P247 DR
R494 P247 n165 1k
R495 n165 VSS 4.8k
J_B165 N277 2Lower2 P248 DR
J_A83 P248 2Upper0 0 DR
R496 VDD N278 100k
J_F166 VDD N278 P249 DR
R497 P249 n166 1k
R498 n166 VSS 4.8k
J_B166 N278 n165 0 DR
R499 VDD N279 100k
J_F167 VDD N279 P250 DR
R500 P250 n167 1k
R501 n167 VSS 4.8k
J_B167 N279 OP P251 DR
J_A84 P251 n166 0 DR
R502 VDD N280 100k
J_F168 VDD N280 P252 DR
R503 P252 SLT 1k
R504 SLT VSS 4.8k
J_B168 N280 n167 0 DR
R505 VDD N281 100k
J_F169 VDD N281 P253 DR
R506 P253 n169 1k
R507 n169 VSS 4.8k
J_B169 N281 2Lower3 P254 DR
J_A85 P254 2Upper0 0 DR
R508 VDD N282 100k
J_F170 VDD N282 P255 DR
R509 P255 n170 1k
R510 n170 VSS 4.8k
J_B170 N282 n169 0 DR
R511 VDD N283 100k
J_F171 VDD N283 P256 DR
R512 P256 n171 1k
R513 n171 VSS 4.8k
J_B171 N283 OP P257 DR
J_A86 P257 n170 0 DR
R514 VDD N284 100k
J_F172 VDD N284 P258 DR
R515 P258 SLTU 1k
R516 SLTU VSS 4.8k
J_B172 N284 n171 0 DR
R517 VDD N285 100k
J_F173 VDD N285 P259 DR
R518 P259 n173 1k
R519 n173 VSS 4.8k
J_B173 N285 2Lower0 P260 DR
J_A87 P260 2Upper1 0 DR
R520 VDD N286 100k
J_F174 VDD N286 P261 DR
R521 P261 n174 1k
R522 n174 VSS 4.8k
J_B174 N286 n173 0 DR
R523 VDD N287 100k
J_F175 VDD N287 P262 DR
R524 P262 n175 1k
R525 n175 VSS 4.8k
J_B175 N287 OP P263 DR
J_A88 P263 n174 0 DR
R526 VDD N288 100k
J_F176 VDD N288 P264 DR
R527 P264 XOR 1k
R528 XOR VSS 4.8k
J_B176 N288 n175 0 DR
R529 VDD N289 100k
J_F177 VDD N289 P265 DR
R530 P265 n177 1k
R531 n177 VSS 4.8k
J_B177 N289 2Lower1 P266 DR
J_A89 P266 2Upper1 0 DR
R532 VDD N290 100k
J_F178 VDD N290 P267 DR
R533 P267 n178 1k
R534 n178 VSS 4.8k
J_B178 N290 n177 0 DR
R535 VDD N291 100k
J_F179 VDD N291 P268 DR
R536 P268 n179 1k
R537 n179 VSS 4.8k
J_B179 N291 OP P269 DR
J_A90 P269 n178 0 DR
R538 VDD N292 100k
J_F180 VDD N292 P270 DR
R539 P270 SRL_SRA 1k
R540 SRL_SRA VSS 4.8k
J_B180 N292 n179 0 DR
R541 VDD N293 100k
J_F181 VDD N293 P271 DR
R542 P271 n181 1k
R543 n181 VSS 4.8k
J_B181 N293 2Lower2 P272 DR
J_A91 P272 2Upper1 0 DR
R544 VDD N294 100k
J_F182 VDD N294 P273 DR
R545 P273 n182 1k
R546 n182 VSS 4.8k
J_B182 N294 n181 0 DR
R547 VDD N295 100k
J_F183 VDD N295 P274 DR
R548 P274 n183 1k
R549 n183 VSS 4.8k
J_B183 N295 OP P275 DR
J_A92 P275 n182 0 DR
R550 VDD N296 100k
J_F184 VDD N296 P276 DR
R551 P276 OR 1k
R552 OR VSS 4.8k
J_B184 N296 n183 0 DR
R553 VDD N297 100k
J_F185 VDD N297 P277 DR
R554 P277 n185 1k
R555 n185 VSS 4.8k
J_B185 N297 2Lower3 P278 DR
J_A93 P278 2Upper1 0 DR
R556 VDD N298 100k
J_F186 VDD N298 P279 DR
R557 P279 n186 1k
R558 n186 VSS 4.8k
J_B186 N298 n185 0 DR
R559 VDD N299 100k
J_F187 VDD N299 P280 DR
R560 P280 n187 1k
R561 n187 VSS 4.8k
J_B187 N299 OP P281 DR
J_A94 P281 n186 0 DR
R562 VDD N300 100k
J_F188 VDD N300 P282 DR
R563 P282 AND 1k
R564 AND VSS 4.8k
J_B188 N300 n187 0 DR
R565 VDD N301 100k
J_F189 VDD N301 P283 DR
R566 P283 n189 1k
R567 n189 VSS 4.8k
J_B189 N301 SLTI 0 DR
J_B190 N301 ADDI 0 DR
R568 VDD N302 100k
J_F190 VDD N302 P284 DR
R569 P284 n190 1k
R570 n190 VSS 4.8k
J_B191 N302 n189 0 DR
R571 VDD N303 100k
J_F191 VDD N303 P285 DR
R572 P285 n191 1k
R573 n191 VSS 4.8k
J_B192 N303 XORI 0 DR
J_B193 N303 SLTIU 0 DR
R574 VDD N304 100k
J_F192 VDD N304 P286 DR
R575 P286 n192 1k
R576 n192 VSS 4.8k
J_B194 N304 n191 0 DR
R577 VDD N305 100k
J_F193 VDD N305 P287 DR
R578 P287 n193 1k
R579 n193 VSS 4.8k
J_B195 N305 n192 0 DR
J_B196 N305 n190 0 DR
R580 VDD N306 100k
J_F194 VDD N306 P288 DR
R581 P288 n194 1k
R582 n194 VSS 4.8k
J_B197 N306 n193 0 DR
R583 VDD N307 100k
J_F195 VDD N307 P289 DR
R584 P289 n195 1k
R585 n195 VSS 4.8k
J_B198 N307 ANDI 0 DR
J_B199 N307 ORI 0 DR
R586 VDD N308 100k
J_F196 VDD N308 P290 DR
R587 P290 n196 1k
R588 n196 VSS 4.8k
J_B200 N308 n195 0 DR
R589 VDD N309 100k
J_F197 VDD N309 P291 DR
R590 P291 n197 1k
R591 n197 VSS 4.8k
J_B201 N309 SRLI_SRAI 0 DR
J_B202 N309 SLLI 0 DR
R592 VDD N310 100k
J_F198 VDD N310 P292 DR
R593 P292 n198 1k
R594 n198 VSS 4.8k
J_B203 N310 n197 0 DR
R595 VDD N311 100k
J_F199 VDD N311 P293 DR
R596 P293 n199 1k
R597 n199 VSS 4.8k
J_B204 N311 n198 0 DR
J_B205 N311 n196 0 DR
R598 VDD N312 100k
J_F200 VDD N312 P294 DR
R599 P294 n200 1k
R600 n200 VSS 4.8k
J_B206 N312 n199 0 DR
R601 VDD N313 100k
J_F201 VDD N313 P295 DR
R602 P295 n201 1k
R603 n201 VSS 4.8k
J_B207 N313 n200 0 DR
J_B208 N313 n194 0 DR
R604 VDD N314 100k
J_F202 VDD N314 P296 DR
R605 P296 ALU_IMM 1k
R606 ALU_IMM VSS 4.8k
J_B209 N314 n201 0 DR
R607 VDD N315 100k
J_F203 VDD N315 P297 DR
R608 P297 n203 1k
R609 n203 VSS 4.8k
J_B210 N315 SLL 0 DR
J_B211 N315 ADD_SUB 0 DR
R610 VDD N316 100k
J_F204 VDD N316 P298 DR
R611 P298 n204 1k
R612 n204 VSS 4.8k
J_B212 N316 n203 0 DR
R613 VDD N317 100k
J_F205 VDD N317 P299 DR
R614 P299 n205 1k
R615 n205 VSS 4.8k
J_B213 N317 SLTU 0 DR
J_B214 N317 SLT 0 DR
R616 VDD N318 100k
J_F206 VDD N318 P300 DR
R617 P300 n206 1k
R618 n206 VSS 4.8k
J_B215 N318 n205 0 DR
R619 VDD N319 100k
J_F207 VDD N319 P301 DR
R620 P301 n207 1k
R621 n207 VSS 4.8k
J_B216 N319 n206 0 DR
J_B217 N319 n204 0 DR
R622 VDD N320 100k
J_F208 VDD N320 P302 DR
R623 P302 n208 1k
R624 n208 VSS 4.8k
J_B218 N320 n207 0 DR
R625 VDD N321 100k
J_F209 VDD N321 P303 DR
R626 P303 n209 1k
R627 n209 VSS 4.8k
J_B219 N321 SRL_SRA 0 DR
J_B220 N321 XOR 0 DR
R628 VDD N322 100k
J_F210 VDD N322 P304 DR
R629 P304 n210 1k
R630 n210 VSS 4.8k
J_B221 N322 n209 0 DR
R631 VDD N323 100k
J_F211 VDD N323 P305 DR
R632 P305 n211 1k
R633 n211 VSS 4.8k
J_B222 N323 AND 0 DR
J_B223 N323 OR 0 DR
R634 VDD N324 100k
J_F212 VDD N324 P306 DR
R635 P306 n212 1k
R636 n212 VSS 4.8k
J_B224 N324 n211 0 DR
R637 VDD N325 100k
J_F213 VDD N325 P307 DR
R638 P307 n213 1k
R639 n213 VSS 4.8k
J_B225 N325 n212 0 DR
J_B226 N325 n210 0 DR
R640 VDD N326 100k
J_F214 VDD N326 P308 DR
R641 P308 n214 1k
R642 n214 VSS 4.8k
J_B227 N326 n213 0 DR
R643 VDD N327 100k
J_F215 VDD N327 P309 DR
R644 P309 n215 1k
R645 n215 VSS 4.8k
J_B228 N327 n214 0 DR
J_B229 N327 n208 0 DR
R646 VDD N328 100k
J_F216 VDD N328 P310 DR
R647 P310 ALU_REG 1k
R648 ALU_REG VSS 4.8k
J_B230 N328 n215 0 DR
R649 VDD N329 100k
J_F217 VDD N329 P311 DR
R650 P311 n217 1k
R651 n217 VSS 4.8k
J_B231 N329 BLT 0 DR
J_B232 N329 BNE 0 DR
R652 VDD N330 100k
J_F218 VDD N330 P312 DR
R653 P312 n218 1k
R654 n218 VSS 4.8k
J_B233 N330 n217 0 DR
R655 VDD N331 100k
J_F219 VDD N331 P313 DR
R656 P313 n219 1k
R657 n219 VSS 4.8k
J_B234 N331 n218 0 DR
J_B235 N331 BEQ 0 DR
R658 VDD N332 100k
J_F220 VDD N332 P314 DR
R659 P314 n220 1k
R660 n220 VSS 4.8k
J_B236 N332 n219 0 DR
R661 VDD N333 100k
J_F221 VDD N333 P315 DR
R662 P315 n221 1k
R663 n221 VSS 4.8k
J_B237 N333 BGEU 0 DR
J_B238 N333 BLTU 0 DR
R664 VDD N334 100k
J_F222 VDD N334 P316 DR
R665 P316 n222 1k
R666 n222 VSS 4.8k
J_B239 N334 n221 0 DR
R667 VDD N335 100k
J_F223 VDD N335 P317 DR
R668 P317 n223 1k
R669 n223 VSS 4.8k
J_B240 N335 n222 0 DR
J_B241 N335 BGE 0 DR
R670 VDD N336 100k
J_F224 VDD N336 P318 DR
R671 P318 n224 1k
R672 n224 VSS 4.8k
J_B242 N336 n223 0 DR
R673 VDD N337 100k
J_F225 VDD N337 P319 DR
R674 P319 n225 1k
R675 n225 VSS 4.8k
J_B243 N337 n224 0 DR
J_B244 N337 n220 0 DR
R676 VDD N338 100k
J_F226 VDD N338 P320 DR
R677 P320 BRANCH_ANY 1k
R678 BRANCH_ANY VSS 4.8k
J_B245 N338 n225 0 DR
R679 VDD N339 100k
J_F227 VDD N339 P321 DR
R680 P321 n227 1k
R681 n227 VSS 4.8k
J_B246 N339 LH 0 DR
J_B247 N339 LB 0 DR
R682 VDD N340 100k
J_F228 VDD N340 P322 DR
R683 P322 n228 1k
R684 n228 VSS 4.8k
J_B248 N340 n227 0 DR
R685 VDD N341 100k
J_F229 VDD N341 P323 DR
R686 P323 n229 1k
R687 n229 VSS 4.8k
J_B249 N341 LHU 0 DR
J_B250 N341 LBU 0 DR
R688 VDD N342 100k
J_F230 VDD N342 P324 DR
R689 P324 n230 1k
R690 n230 VSS 4.8k
J_B251 N342 n229 0 DR
R691 VDD N343 100k
J_F231 VDD N343 P325 DR
R692 P325 n231 1k
R693 n231 VSS 4.8k
J_B252 N343 n230 0 DR
J_B253 N343 LW 0 DR
R694 VDD N344 100k
J_F232 VDD N344 P326 DR
R695 P326 n232 1k
R696 n232 VSS 4.8k
J_B254 N344 n231 0 DR
R697 VDD N345 100k
J_F233 VDD N345 P327 DR
R698 P327 n233 1k
R699 n233 VSS 4.8k
J_B255 N345 n232 0 DR
J_B256 N345 n228 0 DR
R700 VDD N346 100k
J_F234 VDD N346 P328 DR
R701 P328 LOAD_ANY 1k
R702 LOAD_ANY VSS 4.8k
J_B257 N346 n233 0 DR
R703 VDD N347 100k
J_F235 VDD N347 P329 DR
R704 P329 n235 1k
R705 n235 VSS 4.8k
J_B258 N347 SW 0 DR
J_B259 N347 SH 0 DR
R706 VDD N348 100k
J_F236 VDD N348 P330 DR
R707 P330 n236 1k
R708 n236 VSS 4.8k
J_B260 N348 n235 0 DR
R709 VDD N349 100k
J_F237 VDD N349 P331 DR
R710 P331 n237 1k
R711 n237 VSS 4.8k
J_B261 N349 n236 0 DR
J_B262 N349 SB 0 DR
R712 VDD N350 100k
J_F238 VDD N350 P332 DR
R713 P332 STORE_ANY 1k
R714 STORE_ANY VSS 4.8k
J_B263 N350 n237 0 DR
R715 VDD N351 100k
J_F239 VDD N351 P333 DR
R716 P333 n239 1k
R717 n239 VSS 4.8k
J_B264 N351 JALR 0 DR
J_B265 N351 JAL 0 DR
R718 VDD N352 100k
J_F240 VDD N352 P334 DR
R719 P334 JUMP 1k
R720 JUMP VSS 4.8k
J_B266 N352 n239 0 DR
.model NJF NJF
.model PJF PJF
.lib standard.jft
.backanno
.end